# Altium schematic sheet 调试烧写.SchDoc
size A4
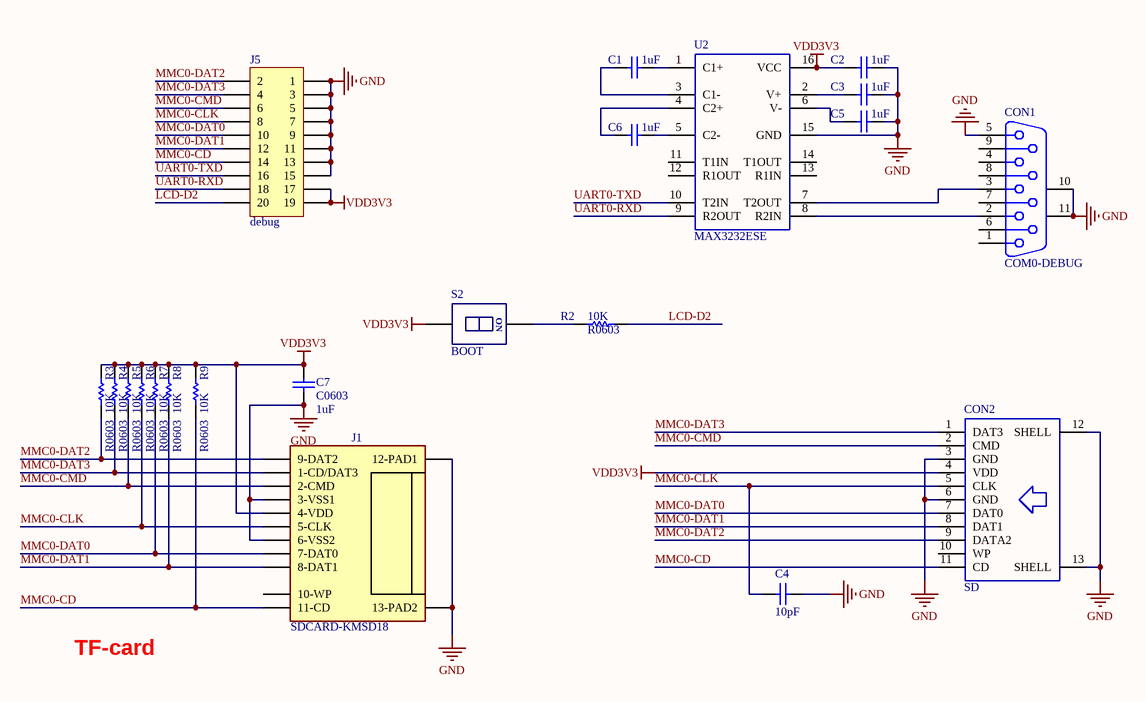
[diagram p0: 调试烧写.SchDoc]

## Parts
C1  value 1uF  [C0603_M1608]  (hidden comment: Cap)
C2  value 1uF  [C0603_M1608]  (hidden comment: Cap)
C3  value 1uF  [C0603_M1608]  (hidden comment: Cap)
C4  value 10pF  [C0603_M1608]  (hidden comment: Cap)
C5  value 1uF  [C0603_M1608]  (hidden comment: Cap)
C6  value 1uF  [C0603_M1608]  (hidden comment: Cap)
C7  C0603  value 1uF  [C0603_M1608]
CON1  COM0-DEBUG  [DSUB1.385-2H9-M]
CON2  SD  [SD-CARD3]
J1  SDCARD-KMSD18  [TF-CARD]
J5  debug  [IDC20S]
R2  R0603  value 10K  [R0603_M1608]
R3  R0603  value 10K  [R0603_M1608]
R4  R0603  value 10K  [R0603_M1608]
R5  R0603  value 10K  [R0603_M1608]
R6  R0603  value 10K  [R0603_M1608]
R7  R0603  value 10K  [R0603_M1608]
R8  R0603  value 10K  [R0603_M1608]
R9  R0603  value 10K  [R0603_M1608]
S2  BOOT  [SWITCH_1P]
U2  MAX3232ESE  [SOIC-16N]

## Nets
GND: C2.1 C3.1 C4.1 C5.1 C7.1 CON1.5 CON1.10(MH1) CON1.11(MH2) CON2.3(GND) CON2.6(GND) CON2.12(SHELL) CON2.13(SHELL) J1.3(3-VSS1) J1.6(6-VSS2) J1.12(12-PAD1) J1.13(13-PAD2) J5.1 J5.3 J5.5 J5.7 J5.9 J5.11 J5.13 J5.15 U2.15(GND)
VDD3V3: C2.2 C7.2 CON2.4(VDD) J1.4(4-VDD) J5.17 J5.19 R3.2 R4.2 R5.2 R6.2 R7.2 R8.2 R9.2 S2.1 U2.16(VCC)
LCD-D2: J5.20 R2.2
MMC0-CD: CON2.11(CD) J1.11(11-CD) J5.14 R9.1
MMC0-CLK: C4.2 CON2.5(CLK) J1.5(5-CLK) J5.8 R6.1
MMC0-CMD: CON2.2(CMD) J1.2(2-CMD) J5.6 R5.1
MMC0-DAT0: CON2.7(DAT0) J1.7(7-DAT0) J5.10 R7.1
MMC0-DAT1: CON2.8(DAT1) J1.8(8-DAT1) J5.12 R8.1
MMC0-DAT2: CON2.9(DATA2) J1.9(9-DAT2) J5.2 R3.1
MMC0-DAT3: CON2.1(DAT3) J1.1(1-CD/DAT3) J5.4 R4.1
UART0-RXD: J5.18 U2.9(R2OUT)
UART0-TXD: J5.16 U2.10(T2IN)
NetC1_1: C1.1 U2.1(C1+)
NetC1_2: C1.2 U2.3(C1-)
NetC3_2: C3.2 U2.2(V+)
NetC5_2: C5.2 U2.6(V-)
NetC6_1: C6.1 U2.5(C2-)
NetC6_2: C6.2 U2.4(C2+)
NetCON1_2: CON1.2 U2.8(R2IN)
NetCON1_3: CON1.3 U2.7(T2OUT)
NetR2_1: R2.1 S2.2

Not connected (* = marked no-connect by the designer): CON1 1 4 6 7 8 9; CON2 10(WP); J1 10(10-WP); U2 11(T1IN) 12(R1OUT) 13(R1IN) 14(T1OUT)

## Notes on the sheet
- TF-card
- (in symbol SW DIP-1) ON

## Library data of the parts
C1-C7 = Cap: Capacitor; Published: 8-Jun-2000; LatestRevisionDate: 17-Jul-2002; LatestRevisionNote: Re-released for DXP Platform.; PackageReference: RAD-0.3; Publisher: Altium Limited
  C1-C6: PackageDescription: Radial Cap, Thru-Hole; 2 Leads; 0.3 in Pin Spacing
CON1 = D Connector 9: Receptacle Assembly, 9 Position, Right Angle; PackageDocument: O; Positions: 9; Published: 15-Jun-2001; LatestRevisionDate: 17-Jul-2002; LatestRevisionNote: Re-released for DXP Platform.; DatasheetDocument: 1-Sep-1999; PackageReference: 788750; Publisher: Altium Limited; Orientation: Right Angle; Gender: Receptacle
J1 = SDCARD_KMSD18
J5 = Header 10X2: Header, 10-Pin, Dual row; LatestRevisionDate: 17-Jul-2002; LatestRevisionNote: Re-released for DXP Platform.; Publisher: Altium Limited
R2-R9 = Res1: Resistor; Published: 8-Jun-2000; LatestRevisionDate: 17-Jul-2002; LatestRevisionNote: Re-released for DXP Platform.; PackageReference: AXIAL-0.3; Publisher: Altium Limited
S2 = SW DIP-1
U2 = MAX3232